# EAGLE design AirValveDriver (EAGLE 7.0.0)
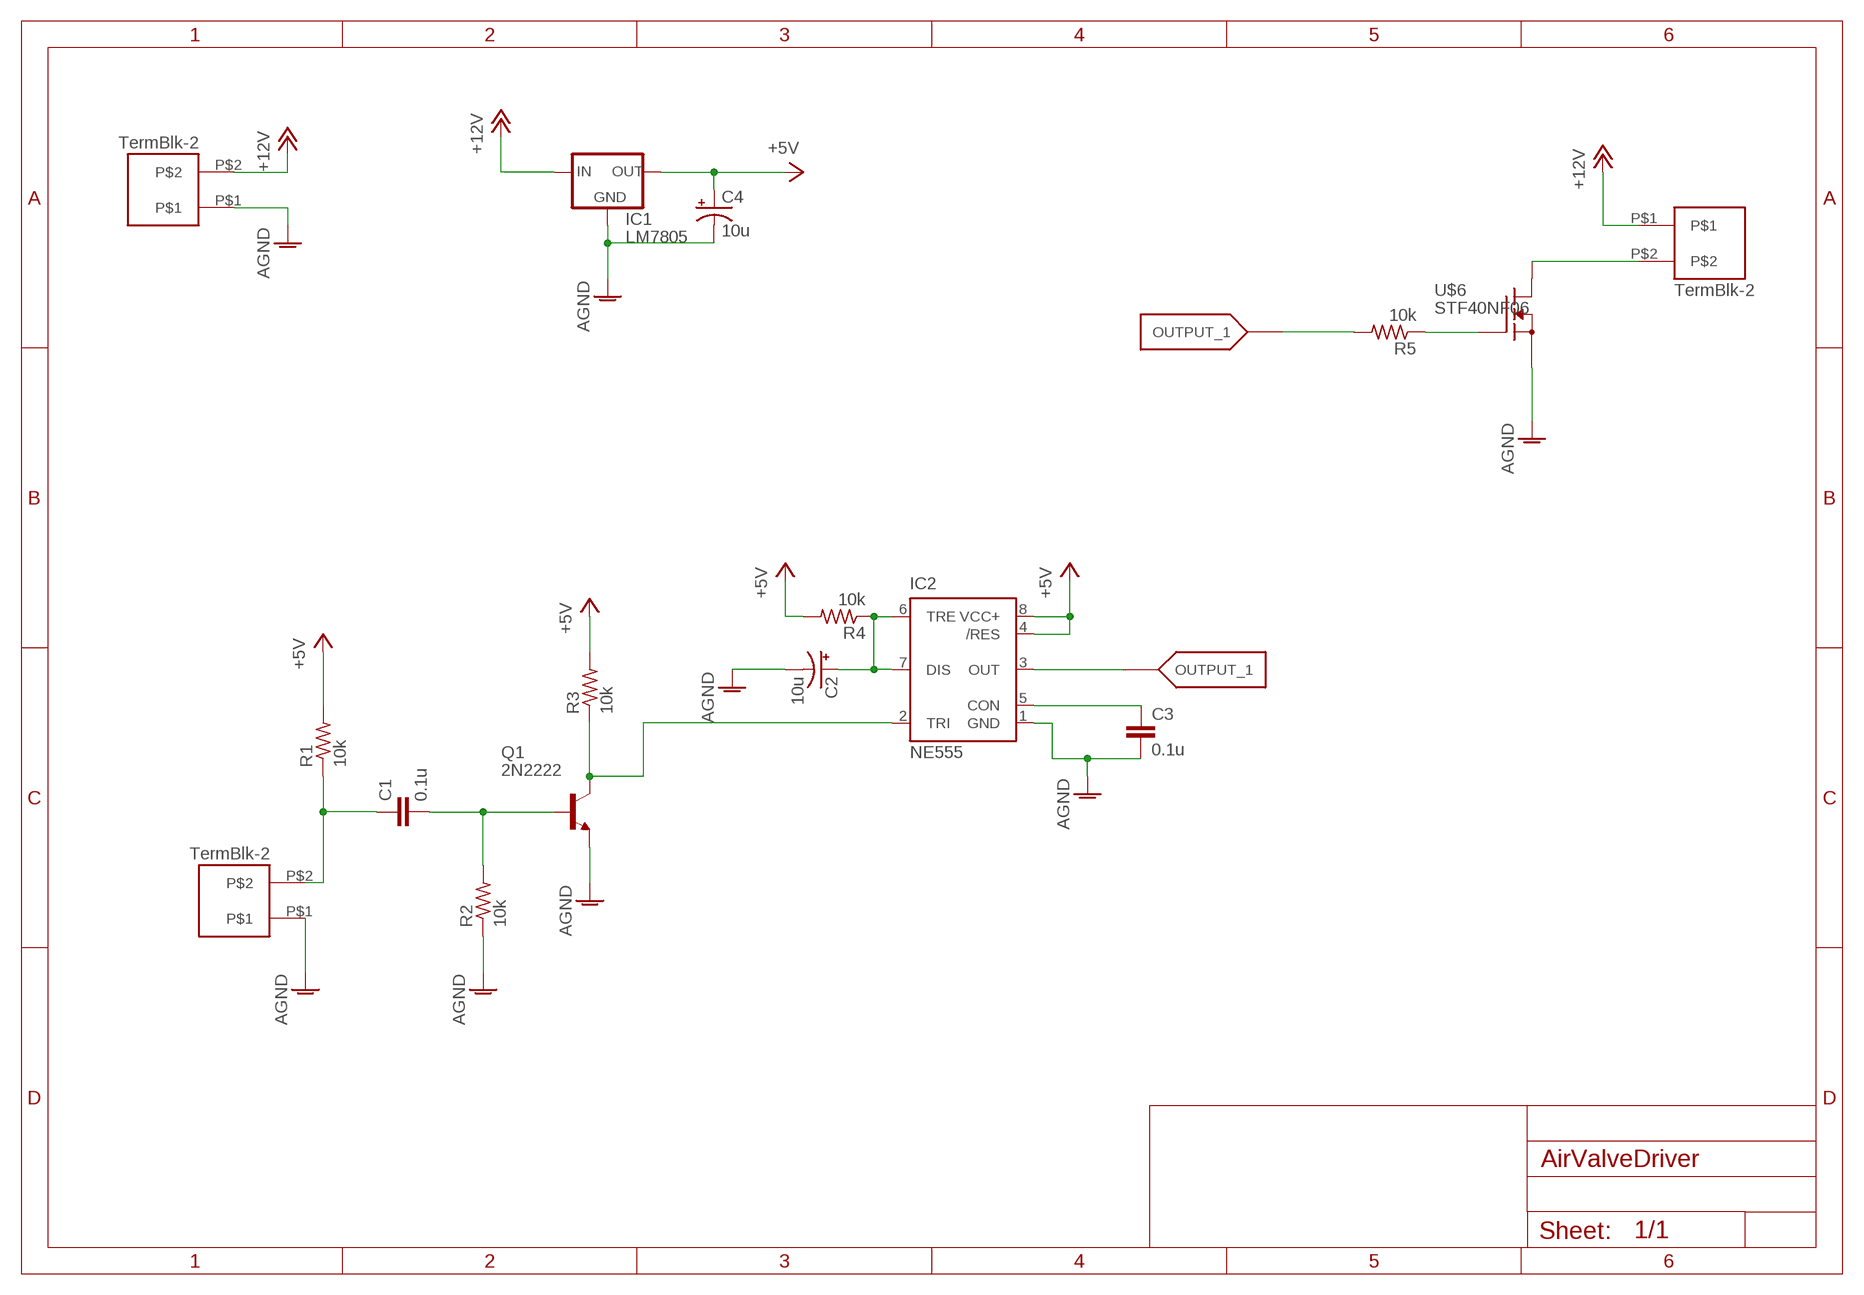
[diagram p0: schematic, sheet 1]

## Parts
C1  0.1u  CAPACITOR_CERAMIC  [CCERAMIC_PKG]
C2  10u  CAPACITOR_POLARIZED  [CPOL_PKG]
C3  0.1u  CAPACITOR_CERAMIC  [CCERAMIC_PKG]
C4  10u  CAPACITOR_POLARIZED  [CPOL_PKG]
IC1  LM7805  78XXL  [78XXL]
IC2  NE555  [DIL-08]
Q1  2N2222  [TO18]
R1  10k  RESISTOR  [RESISTOR_PKG]
R2  10k  RESISTOR  [RESISTOR_PKG]
R3  10k  RESISTOR  [RESISTOR_PKG]
R4  10k  RESISTOR  [RESISTOR_PKG]
R5  10k  RESISTOR  [RESISTOR_PKG]
U$2  TB2  [TB2_PKG]
U$3  Pwr  TB2  [TB2_PKG]
U$5  TB2  [TB2_PKG]
U$6  STF40NF06  [TO220H]

## Nets
+5V: C4.+ IC1.OUT IC2.4(/RES) IC2.8(VCC+) R1.2 R3.2 R4.2
+12V: IC1.IN U$2.P$1 U$3.P$2
AGND: C2.- C3.2 C4.- IC1.GND IC2.1(GND) Q1.1(E) R2.1 U$3.P$1 U$5.P$1 U$6.3(S)
N$1: C3.1 IC2.5(CON)
N$2: R5.1 U$6.1(G)
N$3: U$2.P$2 U$6.2(D)
N$5: C1.1 R1.1 U$5.P$2
N$6: C1.2 Q1.2(B) R2.2
N$7: IC2.2(TRI) Q1.3(C) R3.1
N$10: C2.+ IC2.6(TRE) IC2.7(DIS) R4.1
OUTPUT_1: IC2.3(OUT) R5.2

## Library data of the parts
C1 C3 = myDevices:CAPACITOR_CERAMIC: Capacitor ceramic
C2 C4 = myDevices:CAPACITOR_POLARIZED: Capacitor polarized
IC1 = v-reg:78XXL: VOLTAGE REGULATOR
IC2 = st-microelectronics:NE555: General purpose bipolar Timer; MF: Arrow Electronics; MPN: NE555N; OC_FARNELL: 1467742; OC_NEWARK: 89K1486
Q1 = myDevices:2N2222*: NPN Transistor
R1-R5 = myDevices:RESISTOR: 1/4 Watt Resistor
U$2 U$3 U$5 = myDevices:TB2: Terminal Block with 2 connections
U$6 = myDevices:STF40NF06: STF40NF06 N-Channel MOSFET, 60 V, 23 A

## Board
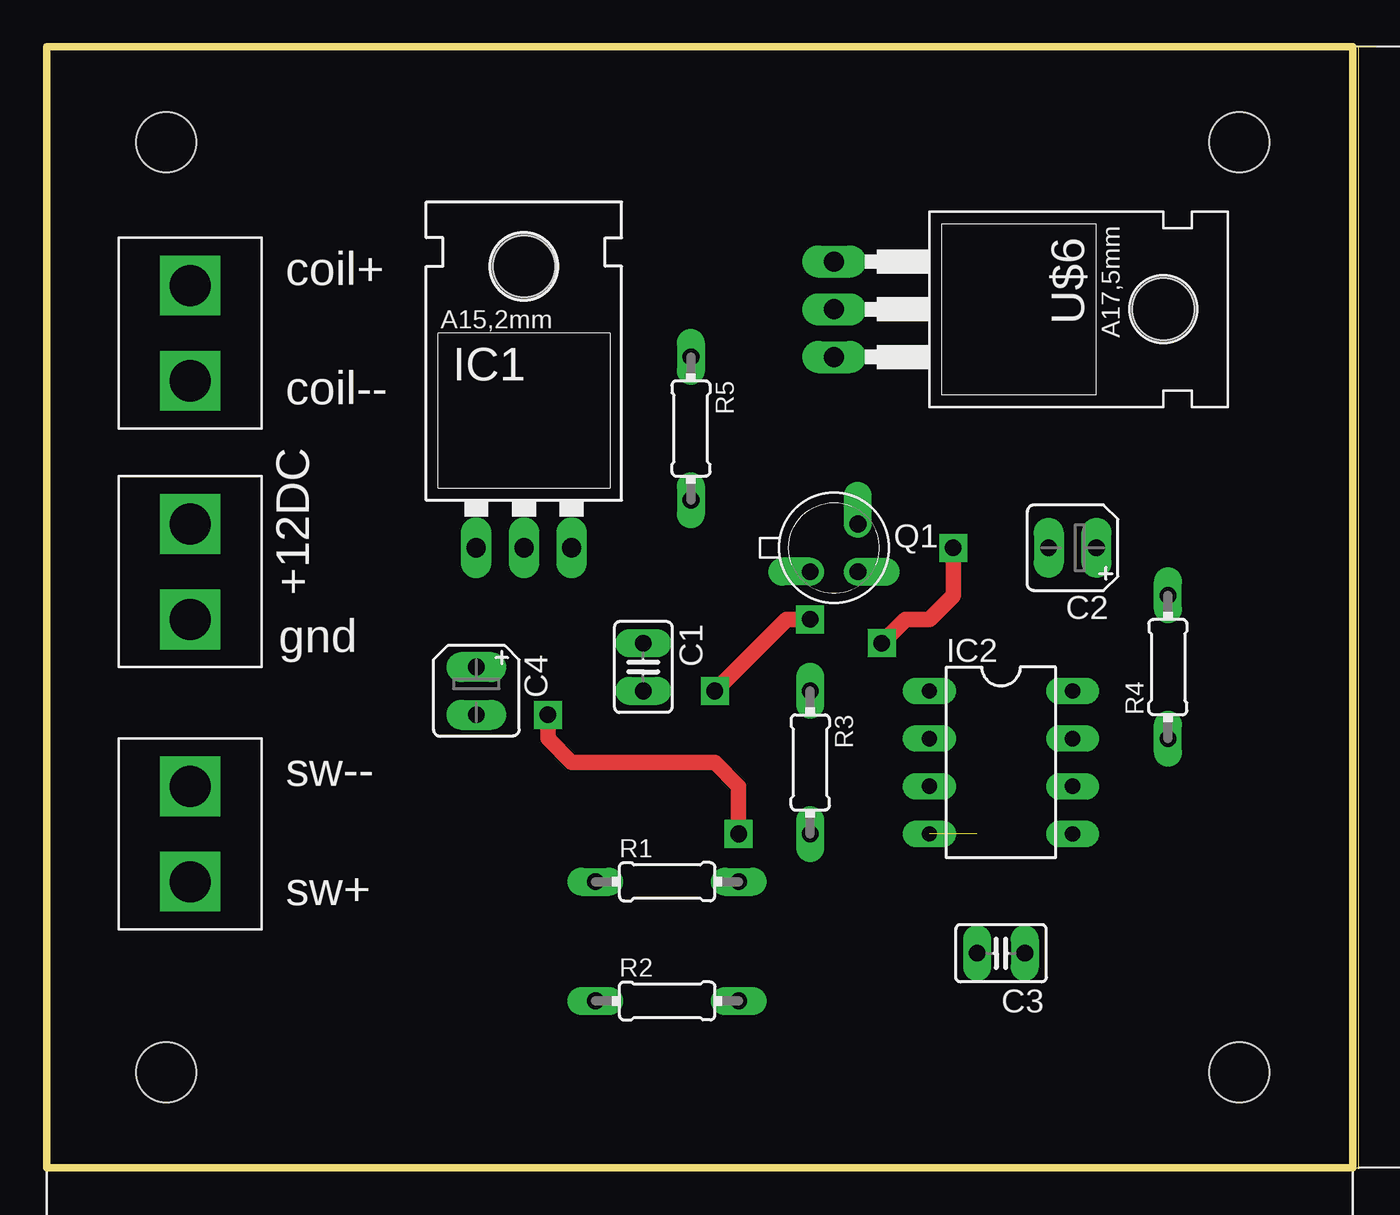
[diagram p1: board, top side]
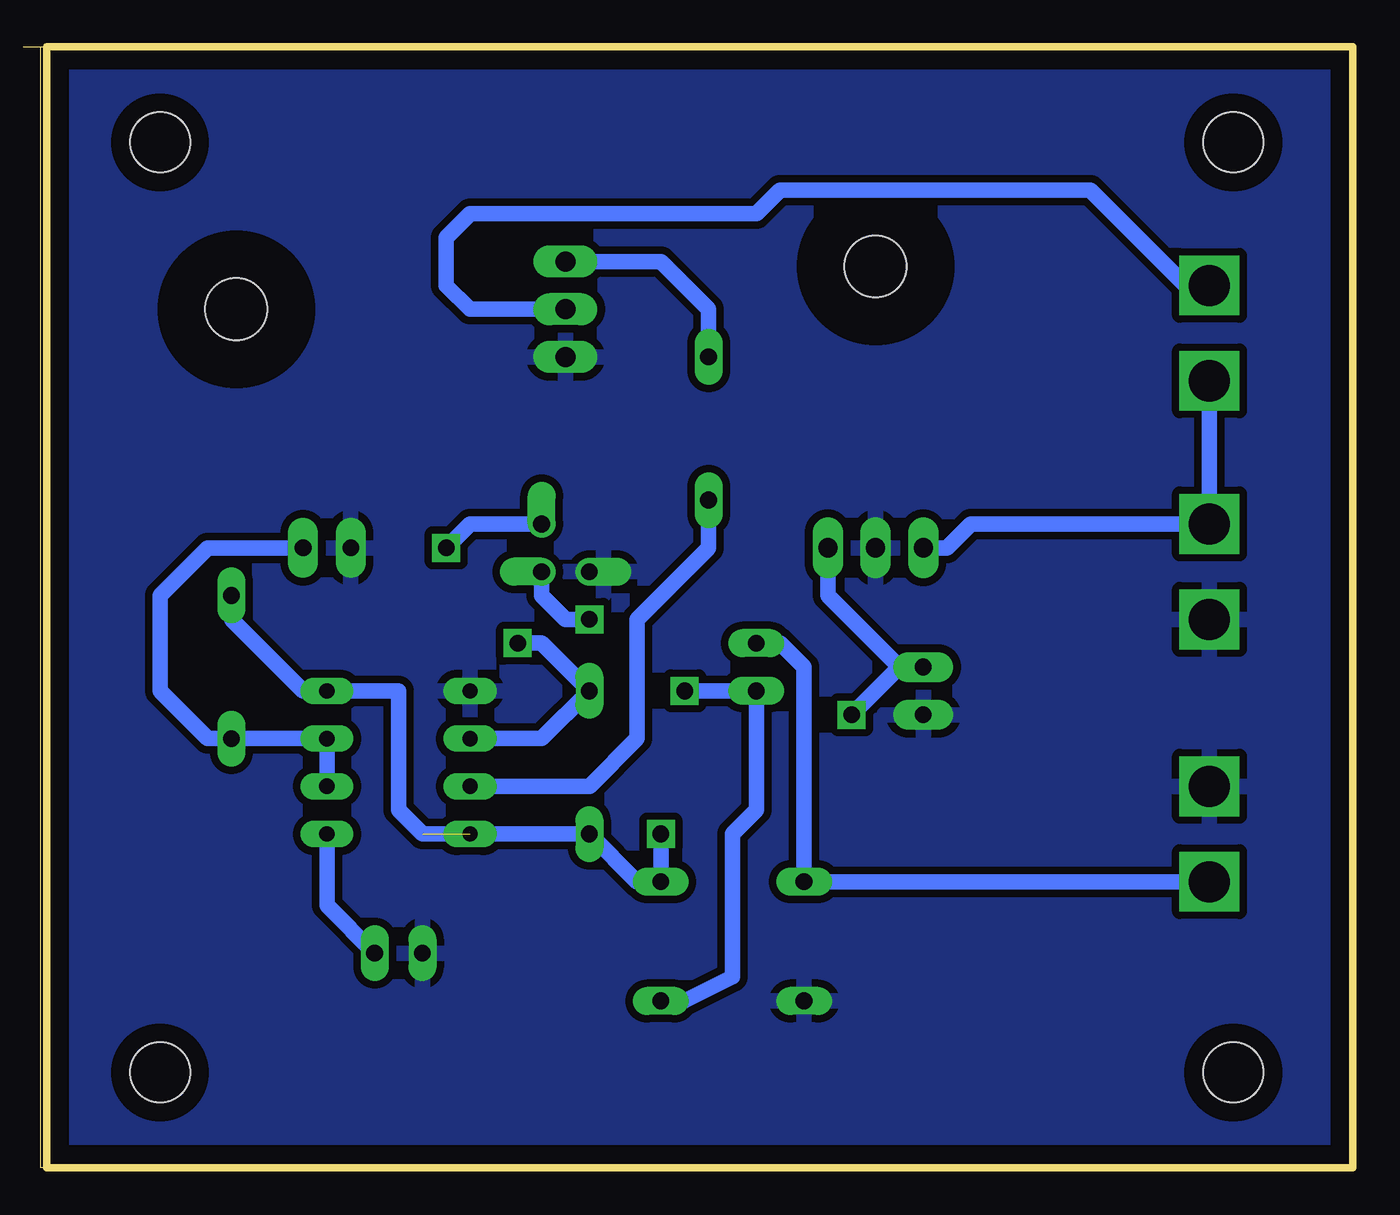
[diagram p2: board, bottom side, seen from below]

Size 69.52 x 59.69 mm. Coordinates in mm from the lower left corner, seen from the top.
Outline: 0,0 69.52,0 69.52,59.69 0,59.69 0,0
Copper layers (1*16): Top 0.035mm / dielectric 1.5mm / Bottom 0.035mm
Design rules "default *": minimum track width 10mil, minimum drill 24mil, track to track 0.405mm, track to pad 0.405mm, pad to pad 0.405mm, via to via 0.405mm, smd to smd 0.405mm, copper to edge 1mm, drill to drill 1mm, minimum pad ring 0.3mm, minimum via ring 0.3mm, stop-mask expansion 4mil, vias tented up to drill 0mil, thermal gap 0.405mm
Holes 3.2 mm at 6.35,54.61 6.35,5.08 63.5,5.08 63.5,54.61
Milling: area 0,0 to 69.8,59.7; 1 lines

### Footprints (pad centres in the part's own frame; a part is rotated, then mirrored left to right if it is on the bottom)
CCERAMIC_PKG = drill 0.889 long: 1 -1.27,0; 2 1.27,0
CPOL_PKG = drill 0.889 pad 1.6 long: + -1.27,0; - 1.27,0
78XXL = drill 1.016 long: GND 0,-3.81; IN -2.54,-3.81; OUT 2.54,-3.81 | hole 3.302: 0,11.176
DIL-08 = drill 0.813 long: 1 -3.81,-3.81; 2 -1.27,-3.81; 3 1.27,-3.81; 4 3.81,-3.81; 5 3.81,3.81; 6 1.27,3.81; 7 -1.27,3.81; 8 -3.81,3.81
TO18 = drill 0.889 offset: 1 -1.27,-1.27; 2 1.27,-1.27; 3 1.27,1.27
RESISTOR_PKG = drill 0.889 long: 1 -3.81,0; 2 3.81,0
TB2_PKG = drill 2.184 square: P$1 0,2.54; P$2 0,-2.54
TO220H = drill 1.067 long: 1 -2.54,-11.43; 2 0,-11.43; 3 2.54,-11.43 | hole 3.302: 0,6.096

### Placement (x,y rotation side)
C1  31.75,26.67 270 top
C2  54.61,33.02 180 top
C3  50.8,11.43 180 top
C4  22.86,25.4 270 top
IC1  25.4,36.83 0 top
IC2  50.8,21.59 270 top
Q1  41.91,33.02 0 top
R1  33.02,15.24 0 top
R2  33.02,8.89 0 top
R3  40.64,21.59 270 top
R4  59.69,26.67 90 top
R5  34.29,39.37 270 top
U$2  7.62,44.45 180 top
U$3  7.62,31.75 180 top
U$5  7.62,17.78 0 top
U$6  53.34,45.72 270 top

### Tracks (layer width: path | path; a pad name or v marks a point on that pad's centre or on a via)
+5V  (via drill 0.89)  (1 unrouted)
  Top 0.813: v26.67,24.13 26.67,22.86 27.94,21.59 35.56,21.59 36.83,20.32 v36.83,17.78
  Bottom 0.813: R4.2 59.69,29.21 55.88,25.4 IC2.8 50.8,25.4 50.8,19.05 49.53,17.78 R3.2 38.1,15.24 R1.2 v36.83,17.78 | IC1.OUT 27.94,30.48 24.13,26.67 | C4.+ 24.13,26.67 | 24.13,26.67 v26.67,24.13
+12V
  Bottom 0.813: U$2.P$1 U$3.P$2 20.32,34.29 21.59,33.02 IC1.IN
AGND
  pour Bottom: 1.27,58.42 68.58,58.42 68.58,1.27 1.27,1.27
N$1
  Bottom 0.813: C3.1 54.61,13.97 IC2.5
N$2
  Bottom 0.813: R5.1 34.29,45.72 36.83,48.26 U$6.1
N$3
  Bottom 0.813: U$6.2 46.99,45.72 48.26,46.99 48.26,49.53 46.99,50.8 31.75,50.8 30.48,52.07 13.97,52.07 8.89,46.99 U$2.P$2
N$5
  Bottom 0.813: U$5.P$2 R1.1 29.21,26.67 30.48,27.94 C1.1
N$6  (via drill 0.89)
  Top 0.813: v40.64,29.21 39.37,29.21 v35.56,25.4
  Bottom 0.813: R2.2 35.56,8.89 33.02,10.16 33.02,17.78 31.75,19.05 C1.2 v35.56,25.4 | Q1.2 43.18,30.48 41.91,29.21 v40.64,29.21
N$7  (via drill 0.89)
  Top 0.813: v48.26,33.02 48.26,30.48 46.99,29.21 45.72,29.21 v44.45,27.94
  Bottom 0.813: IC2.2 43.18,22.86 R3.1 43.18,27.94 v44.45,27.94 | Q1.3 46.99,34.29 v48.26,33.02
N$10
  Bottom 0.813: IC2.6 IC2.7 R4.1 60.96,22.86 63.5,25.4 63.5,30.48 60.96,33.02 C2.+
OUTPUT_1
  Bottom 0.813: IC2.3 40.64,20.32 38.1,22.86 38.1,29.21 34.29,33.02 R5.2

### Text on the board
tNames: coil+ | coil-- | +12DC | gnd | sw-- | sw+
DrillLegend: LAYER-STACK
DrillLegend_01-16: 01-16
DrillLegend_01-20: 01-20